# Altium schematic sheet Sheet2.SchDoc
size A3; SheetNumber: 1; SheetTotal: 1
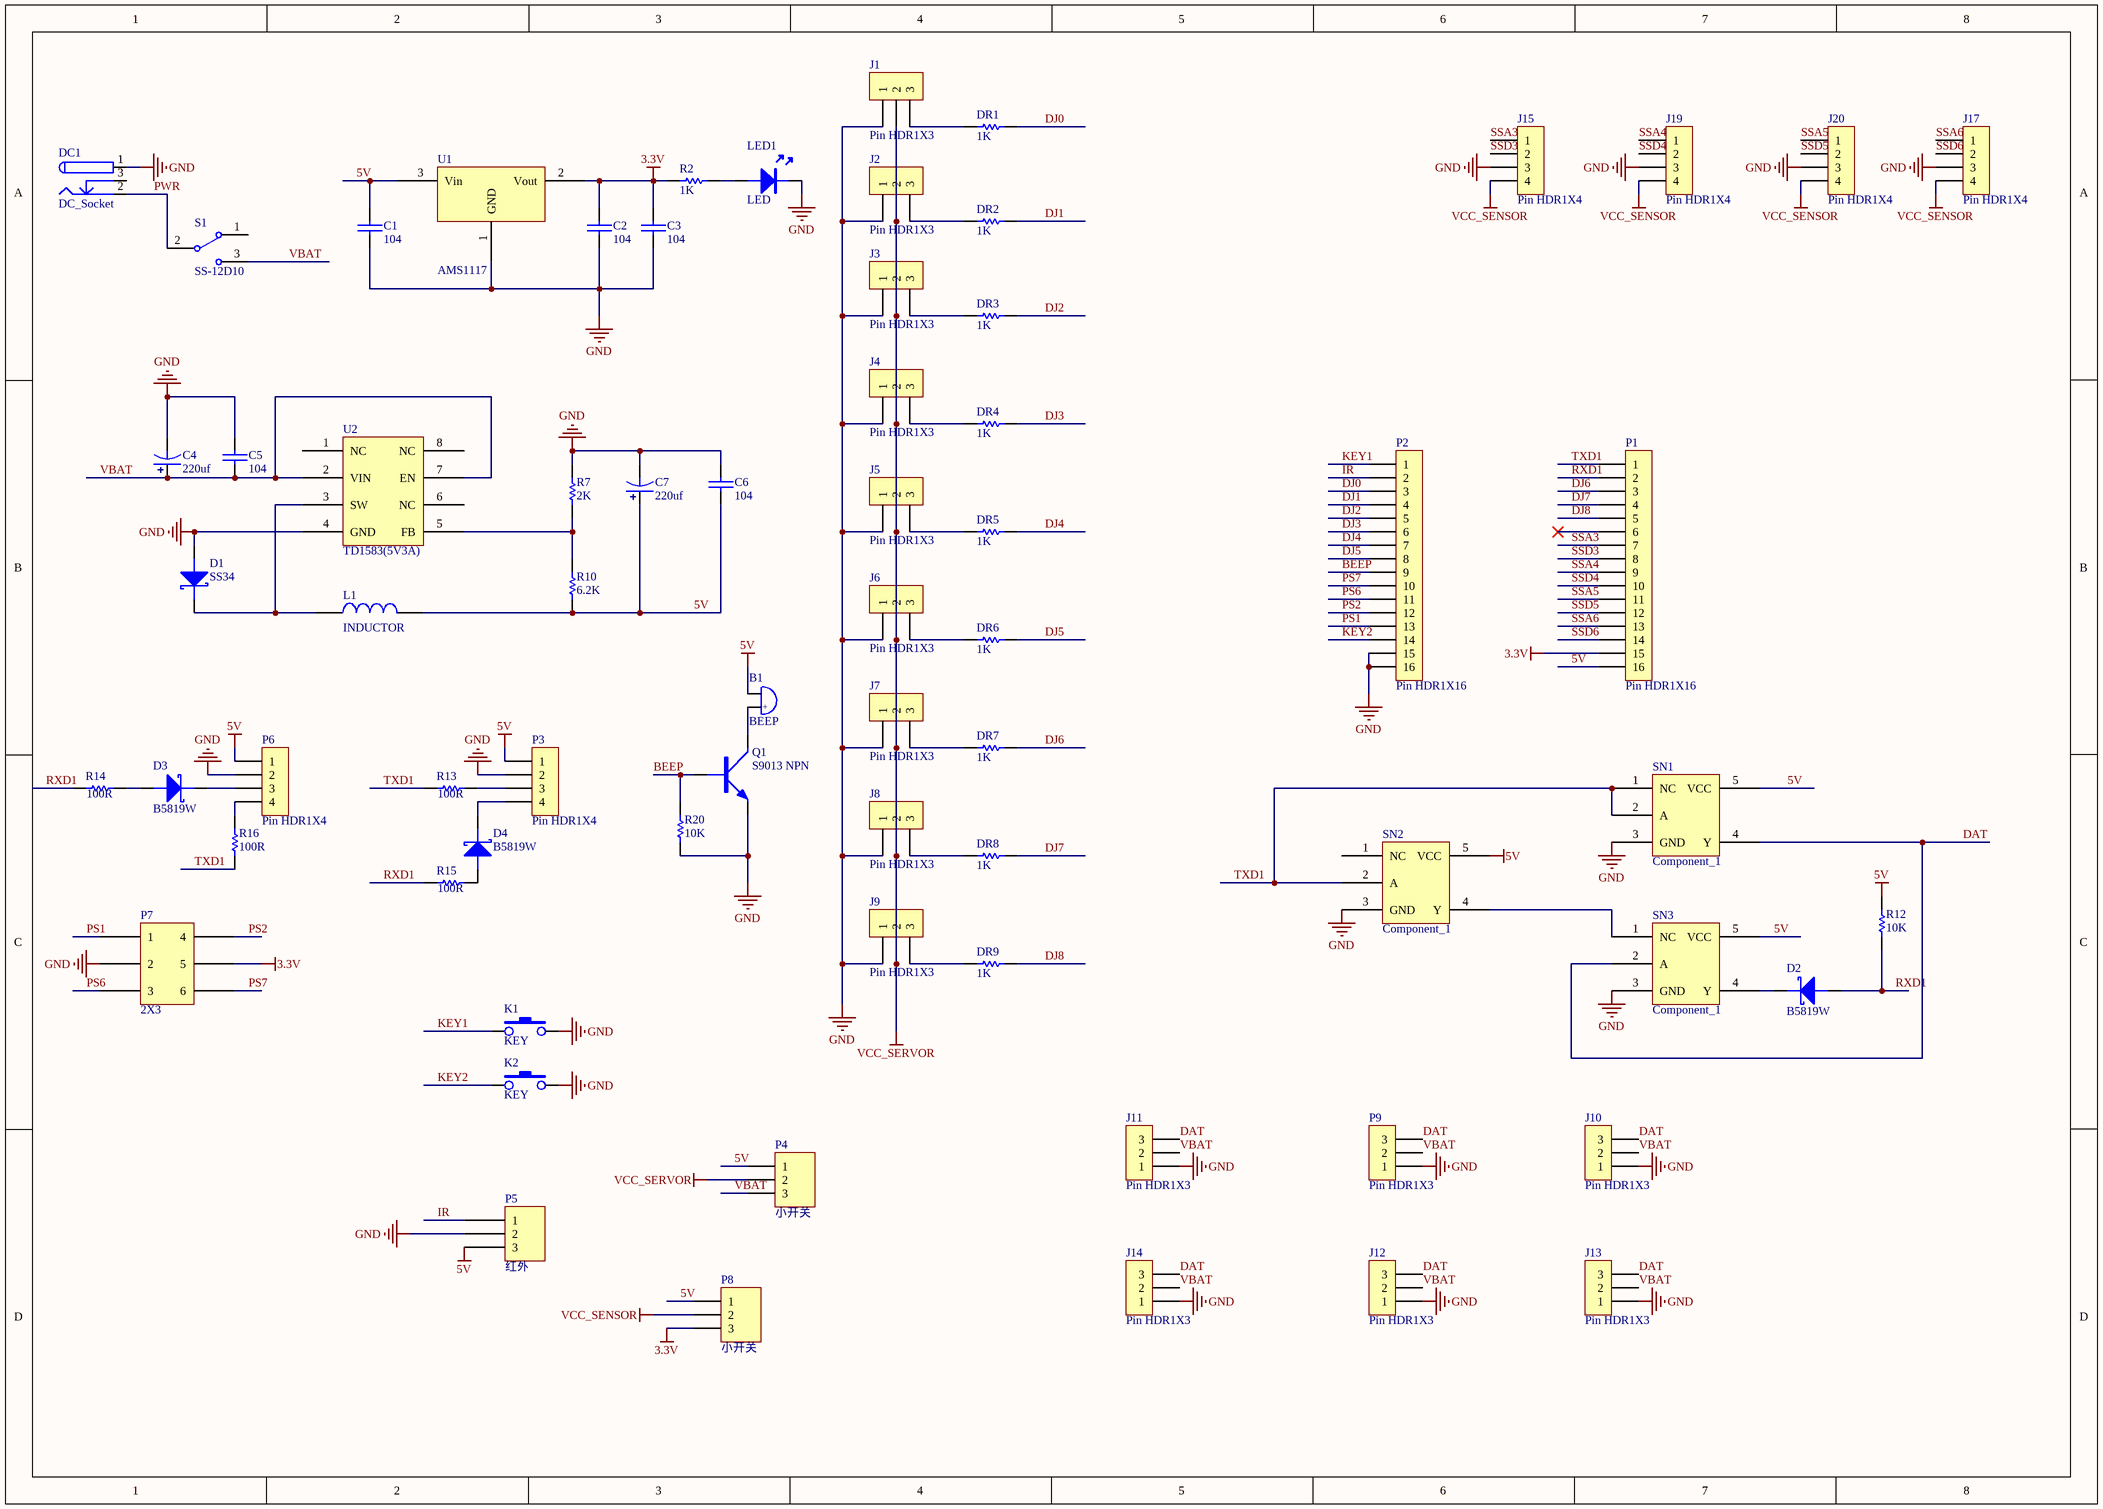
[diagram p0: Sheet2.SchDoc]

## Parts
B1  BEEP  [BEEP 5x9x5.5]
C1  104  [0603C]
C2  104  [0603C]
C3  104  [0603C]
C4  220uf  [SMD-EC6.3X6.3X10]
C5  104  [0603C]
C6  104  [0603C]
C7  220uf  [SMD-EC6.3X6.3X10]
D1  SS34  [SMA/DO-214AC]
D2  B5819W  [SOD-123]
D3  B5819W  [SOD-123]
D4  B5819W  [SOD-123]
DC1  DC_Socket  [DC-005]
DR1  1K  [0603R]
DR2  1K  [0603R]
DR3  1K  [0603R]
DR4  1K  [0603R]
DR5  1K  [0603R]
DR6  1K  [0603R]
DR7  1K  [0603R]
DR8  1K  [0603R]
DR9  1K  [0603R]
J1  Pin HDR1X3  [Pin HDR1X3/2.54mm-S]
J2  Pin HDR1X3  [Pin HDR1X3/2.54mm-S]
J3  Pin HDR1X3  [Pin HDR1X3/2.54mm-S]
J4  Pin HDR1X3  [Pin HDR1X3/2.54mm-S]
J5  Pin HDR1X3  [Pin HDR1X3/2.54mm-S]
J6  Pin HDR1X3  [Pin HDR1X3/2.54mm-S]
J7  Pin HDR1X3  [Pin HDR1X3/2.54mm-S]
J8  Pin HDR1X3  [Pin HDR1X3/2.54mm-S]
J9  Pin HDR1X3  [Pin HDR1X3/2.54mm-S]
J10  Pin HDR1X3  [Pin HDR1X3/2.54mm-S]
J11  Pin HDR1X3  [Pin HDR1X3/2.54mm-S]
J12  Pin HDR1X3  [Pin HDR1X3/2.54mm-S]
J13  Pin HDR1X3  [Pin HDR1X3/2.54mm-S]
J14  Pin HDR1X3  [Pin HDR1X3/2.54mm-S]
J15  Pin HDR1X4  [Pin HDR1X4/2.54mm-S]
J17  Pin HDR1X4  [Pin HDR1X4/2.54mm-S]
J19  Pin HDR1X4  [Pin HDR1X4/2.54mm-S]
J20  Pin HDR1X4  [Pin HDR1X4/2.54mm-S]
K1  KEY  [SMD-3X6X2.5]
K2  KEY  [SMD-3X6X2.5]
L1  INDUCTOR  [0630L]
LED1  LED  [LED-0603Y]
P1  Pin HDR1X16  [Pin HDR1X16/2.54mm-S]
P2  Pin HDR1X16  [Pin HDR1X16/2.54mm-S]
P3  Pin HDR1X4  [Pin HDR1X4/2.54mm-S]
P4  小开关  [小开关]
P5  红外  [红外接收模块]
P6  Pin HDR1X4  [Pin HDR1X4/2.54mm-S]
P7  2X3  [2X3P PH2.0]
P8  小开关  [小开关]
P9  Pin HDR1X3  [Pin HDR1X3/2.54mm-S]
Q1  S9013 NPN  [SOT-23]
R2  1K  [0603R]
R7  2K  [0603R]
R10  6.2K  [0603R]
R12  10K  [0603R]
R13  100R  [0603R]
R14  100R  [0603R]
R15  100R  [0603R]
R16  100R  [0603R]
R20  10K  [0603R]
S1  SS-12D10  [SS-12D10]
SN1  Component_1  [SN74HC]
SN2  Component_1  [SN74HC]
SN3  Component_1  [SN74HC]
U1  AMS1117  [SOT223]
U2  TD1583(5V3A)  [TD1583]

## Nets
3.3V: C2.2 C3.2 P1.15 P7.5 P8.3 R2.1 U1.2(Vout)
5V: B1.2 C1.2 C6.1 C7.1 L1.2 P1.16 P3.1 P4.1 P5.3 P6.1 P8.1 R10.1 R12.1 SN1.5(VCC) SN2.5(VCC) SN3.5(VCC) U1.3(Vin)
GND: C1.1 C2.1 C3.1 C4.2 C5.2 C6.2 C7.2 D1.A DC1.1 J1.1 J2.1 J3.1 J4.1 J5.1 J6.1 J7.1 J8.1 J9.1 J10.1 J11.1 J12.1 J13.1 J14.1 J15.3 J17.3 J19.3 J20.3 K1.3 K2.3 LED1.K P2.15 P2.16 P3.2 P5.2 P6.2 P7.2 P9.1 Q1.E R7.2 R20.1 SN1.3(GND) SN2.3(GND) SN3.3(GND) U1.1(GND) U2.4(GND)
VCC_SENSOR: J15.4 J17.4 J19.4 J20.4 P8.2
VCC_SERVOR: J1.2 J2.2 J3.2 J4.2 J5.2 J6.2 J7.2 J8.2 J9.2 P4.2
BEEP: P2.9 Q1.B R20.2
DAT: J10.3 J11.3 J12.3 J13.3 J14.3 P9.3 SN1.4(Y) SN3.2(A)
DJ0: DR1.2 P2.3
DJ1: DR2.2 P2.4
DJ2: DR3.2 P2.5
DJ3: DR4.2 P2.6
DJ4: DR5.2 P2.7
DJ5: DR6.2 P2.8
DJ6: DR7.2 P1.3
DJ7: DR8.2 P1.4
DJ8: DR9.2 P1.5
IR: P2.2 P5.1
KEY1: K1.1 P2.1
KEY2: K2.1 P2.14
PS1: P2.13 P7.1
PS2: P2.12 P7.4
PS6: P2.11 P7.3
PS7: P2.10 P7.6
PWR: DC1.2 S1.2
RXD1: D2.A P1.2 R12.2 R14.2 R15.2
SSA3: J15.1 P1.7
SSA4: J19.1 P1.9
SSA5: J20.1 P1.11
SSA6: J17.1 P1.13
SSD3: J15.2 P1.8
SSD4: J19.2 P1.10
SSD5: J20.2 P1.12
SSD6: J17.2 P1.14
TXD1: P1.1 R13.2 R16.2 SN1.1(NC) SN1.2(A) SN2.2(A)
VBAT: C4.1 C5.1 J10.2 J11.2 J12.2 J13.2 J14.2 P4.3 P9.2 S1.3 U2.2(VIN) U2.7(EN)
NetB1_1: B1.1 Q1.C
NetD1_K: D1.K L1.1 U2.3(SW)
NetD2_K: D2.K SN3.4(Y)
NetD3_A: D3.A R14.1
NetD3_K: D3.K P6.3
NetD4_A: D4.A R15.1
NetD4_K: D4.K P3.4
NetDR1_1: DR1.1 J1.3
NetDR2_1: DR2.1 J2.3
NetDR3_1: DR3.1 J3.3
NetDR4_1: DR4.1 J4.3
NetDR5_1: DR5.1 J5.3
NetDR6_1: DR6.1 J6.3
NetDR7_1: DR7.1 J7.3
NetDR8_1: DR8.1 J8.3
NetDR9_1: DR9.1 J9.3
NetLED1_A: LED1.A R2.2
NetP3_3: P3.3 R13.1
NetP6_4: P6.4 R16.1
NetR7_1: R7.1 R10.2 U2.5(FB)
NetSN2_4: SN2.4(Y) SN3.1(NC)

Not connected (* = marked no-connect by the designer): DC1 3; P1 6*; S1 1; SN2 1(NC); U2 1(NC) 6(NC) 8(NC)

## Notes on the sheet
- (in symbol BEEP) +

## Library data of the parts
B1 = BEEP: 蜂鸣器
C1-C3 C5 C6 = CAP: 无极性电容
C4 C7 = SMD_ECAP: 贴片电解电容
D1-D4 = DIODE SCHOTTKY: 肖特基二极管
DR1-DR9 R2 R7 R10 R12-R16 R20 = RES
P7 = 2X3 PH3.0: pin to pad: 2>3 3>5 4>2 5>4
Q1 = NPN: NPN三极管
U1 = AMS1117: 三端稳压芯片